# EAGLE design SECUREBRD_002 (EAGLE 7.7.0)

## Sheet 1 of 3
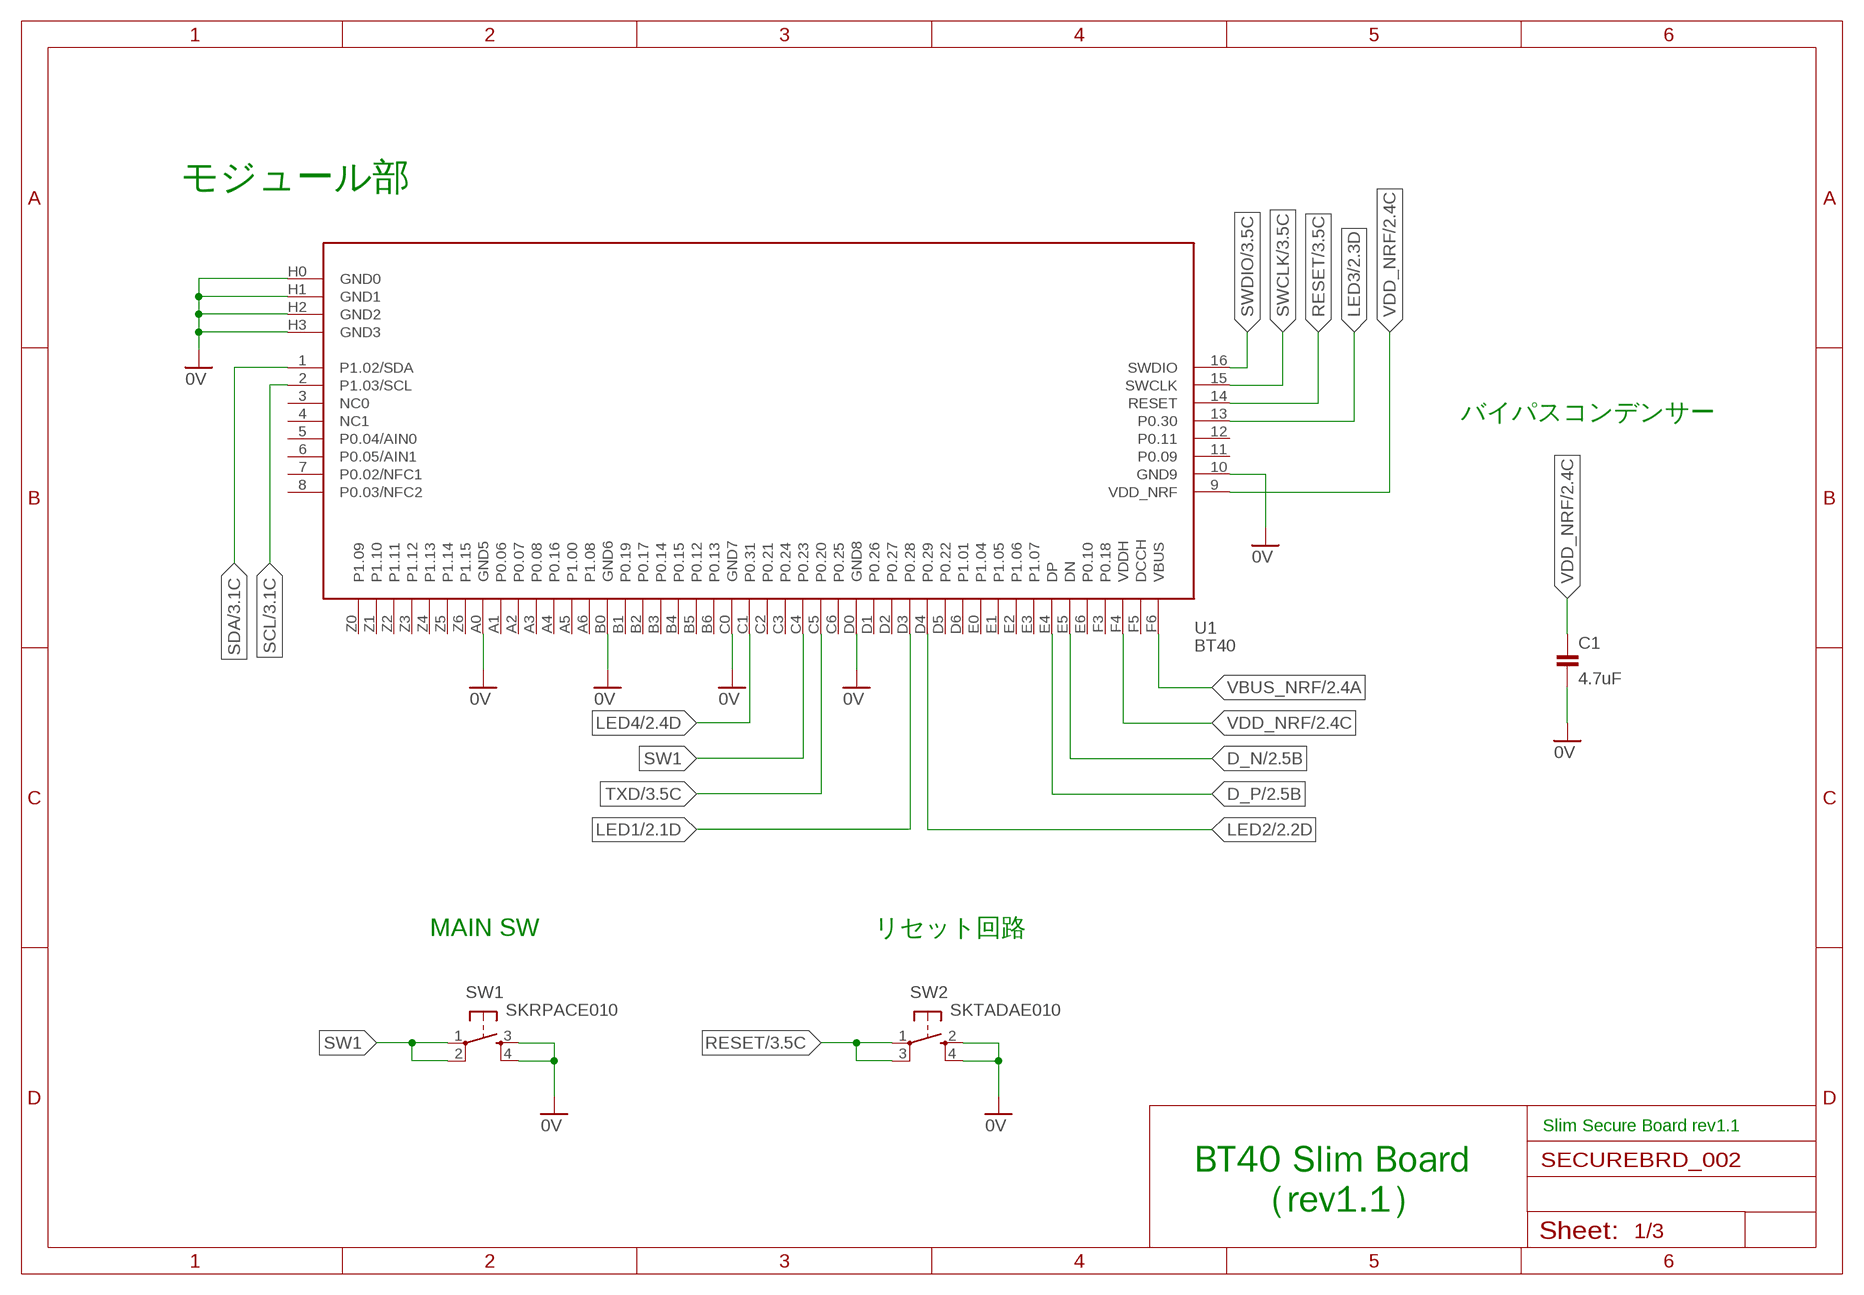
[diagram p0: schematic, sheet 1]

### Parts
C1  4.7uF  CAP_0603  [C0603K]
SW1  SKRPACE010  [SKRPACE010]
SW2  SKTADAE010  [SKTADAE010]
U1  BT40  [BM40-B_1PRIMARY]

### Nets
0V: C1.2 SW1.3(S) SW1.4(S1) SW2.2(S) SW2.4(S1) U1.10(GND9) U1.A0(GND5) U1.B0(GND6) U1.C0(GND7) U1.D0(GND8) U1.H0(GND0) U1.H1(GND1) U1.H2(GND2) U1.H3(GND3) ; also sheet 2,3
D_N: U1.E5(DN) ; also sheet 2
D_P: U1.E4(DP) ; also sheet 2
LED1: U1.D3(P0.28) ; also sheet 2
LED2: U1.D4(P0.29) ; also sheet 2
LED3: U1.13(P0.30) ; also sheet 2
LED4: U1.C1(P0.31) ; also sheet 2
RESET: SW2.1(P) SW2.3(P1) U1.14(RESET) ; also sheet 3
SCL: U1.2(P1.03/SCL) ; also sheet 3
SDA: U1.1(P1.02/SDA) ; also sheet 3
SW1: SW1.1(P) SW1.2(P1) U1.C4(P0.23)
SWCLK: U1.15(SWCLK) ; also sheet 3
SWDIO: U1.16(SWDIO) ; also sheet 3
TXD: U1.C5(P0.20) ; also sheet 3
VBUS_NRF: U1.F6(VBUS) ; also sheet 2,3
VDD_NRF: C1.1 U1.9(VDD_NRF) U1.F4(VDDH) ; also sheet 2,3
Unconnected: U1.3(NC0) U1.4(NC1) U1.5(P0.04/AIN0) U1.6(P0.05/AIN1) U1.7(P0.02/NFC1) U1.8(P0.03/NFC2) U1.11(P0.09) U1.12(P0.11) U1.A1(P0.06) U1.A2(P0.07) U1.A3(P0.08) U1.A4(P0.16) U1.A5(P1.00) U1.A6(P1.08) U1.B1(P0.19) U1.B2(P0.17) U1.B3(P0.14) U1.B4(P0.15) U1.B5(P0.12) U1.B6(P0.13) U1.C2(P0.21) U1.C3(P0.24) U1.C6(P0.25) U1.D1(P0.26) U1.D2(P0.27) U1.D5(P0.22) U1.D6(P1.01) U1.E0(P1.04) U1.E1(P1.05) U1.E2(P1.06) U1.E3(P1.07) U1.E6(P0.10) U1.F3(P0.18) U1.F5(DCCH) U1.Z0(P1.09) U1.Z1(P1.10) U1.Z2(P1.11) U1.Z3(P1.12) U1.Z4(P1.13) U1.Z5(P1.14) U1.Z6(P1.15)

### Notes on the sheet
- モジュール部
- バイパスコンデンサー
- MAIN SW | リセット回路
- Slim Secure Board rev1.1
- BT40 Slim Board
       （rev1.1）

## Sheet 2 of 3
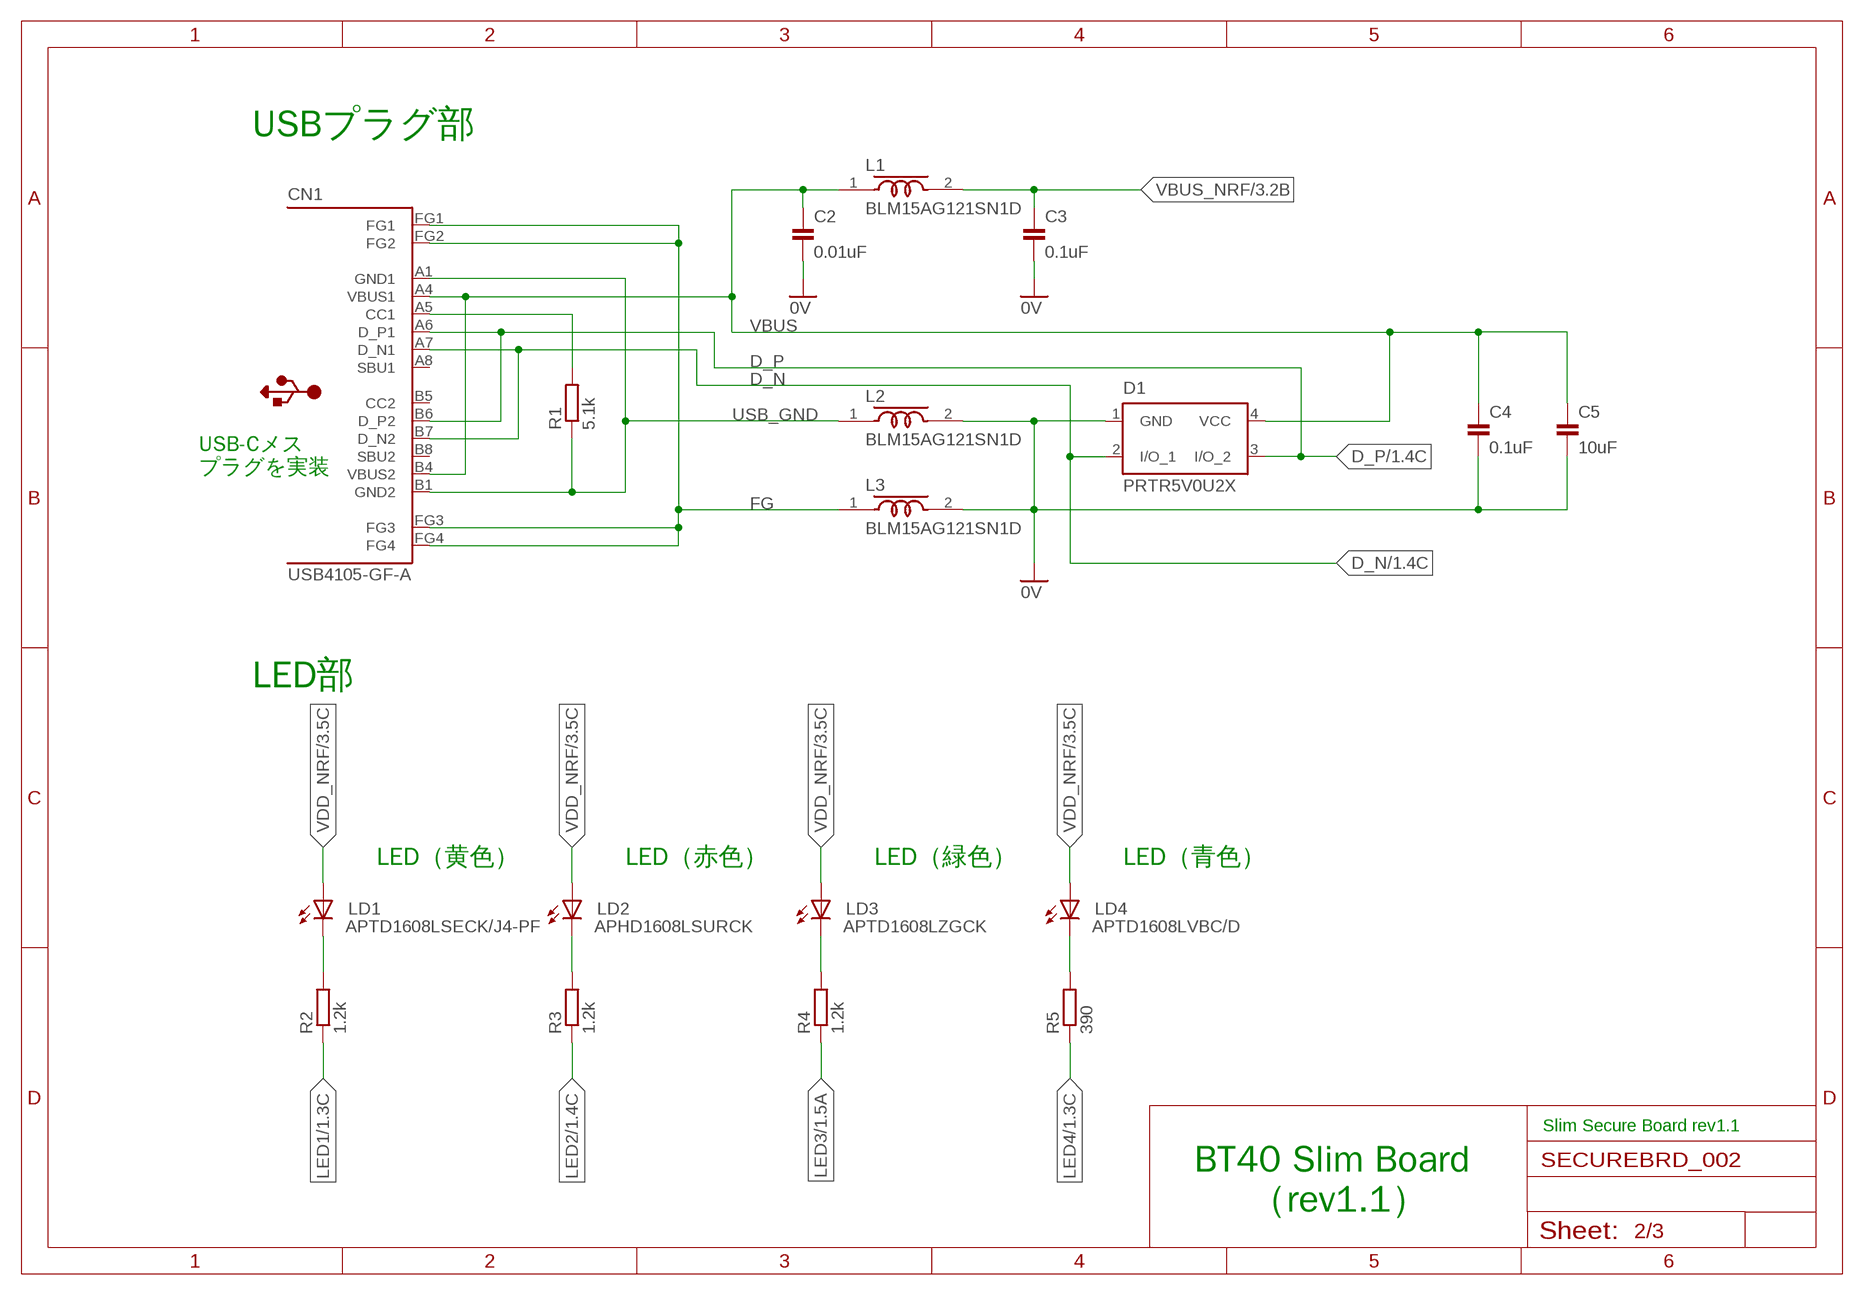
[diagram p1: schematic, sheet 2]

### Parts
C2  0.01uF  CAP_0402K  [C0402K]
C3  0.1uF  CAP_0402K  [C0402K]
C4  0.1uF  CAP_0402K  [C0402K]
C5  10uF  CAP_0603  [C0603K]
CN1  USB4105-GF-A  [USB4105-GF-A]
D1  PRTR5V0U2X  [SOT143B]
L1  BLM15AG121SN1D  [C0402K]
L2  BLM15AG121SN1D  [C0402K]
L3  BLM15AG121SN1D  [C0402K]
LD1  APTD1608LSECK/J4-PF  [APTD1608]
LD2  APHD1608LSURCK  [APTD1608]
LD3  APTD1608LZGCK  [APTD1608]
LD4  APTD1608LVBC/D  [APTD1608]
R1  5.1k  RESISTOR_0402  [R0402]
R2  1.2k  RESISTOR_0402  [R0402]
R3  1.2k  RESISTOR_0402  [R0402]
R4  1.2k  RESISTOR_0402  [R0402]
R5  390  RESISTOR_0402  [R0402]

### Nets
0V: C2.2 C3.2 C4.2 C5.2 D1.1(GND) L2.2 L3.2 ; also sheet 1,3
D_N: CN1.A7(D_N1) CN1.B7(D_N2) D1.2(I/O_1) ; also sheet 1
D_P: CN1.A6(D_P1) CN1.B6(D_P2) D1.3(I/O_2) ; also sheet 1
FG: CN1.FG1 CN1.FG2 CN1.FG3 CN1.FG4 L3.1
LED1: R2.1 ; also sheet 1
LED2: R3.1 ; also sheet 1
LED3: R4.1 ; also sheet 1
LED4: R5.1 ; also sheet 1
N$1: LD4.C R5.2
N$2: CN1.A5(CC1) R1.2
N$6: LD3.C R4.2
N$7: LD2.C R3.2
N$8: LD1.C R2.2
USB_GND: CN1.A1(GND1) CN1.B1(GND2) L2.1 R1.1
VBUS: C2.1 C4.1 C5.1 CN1.A4(VBUS1) CN1.B4(VBUS2) D1.4(VCC) L1.1
VBUS_NRF: C3.1 L1.2 ; also sheet 1,3
VDD_NRF: LD1.A LD2.A LD3.A LD4.A ; also sheet 1,3
Unconnected: CN1.A8(SBU1) CN1.B5(CC2) CN1.B8(SBU2)

### Notes on the sheet
- USBプラグ部
- USB-Cメス
  プラグを実装
- LED部
- LED（黄色） | LED（赤色） | LED（緑色） | LED（青色）
- Slim Secure Board rev1.1
- BT40 Slim Board
       （rev1.1）

## Sheet 3 of 3
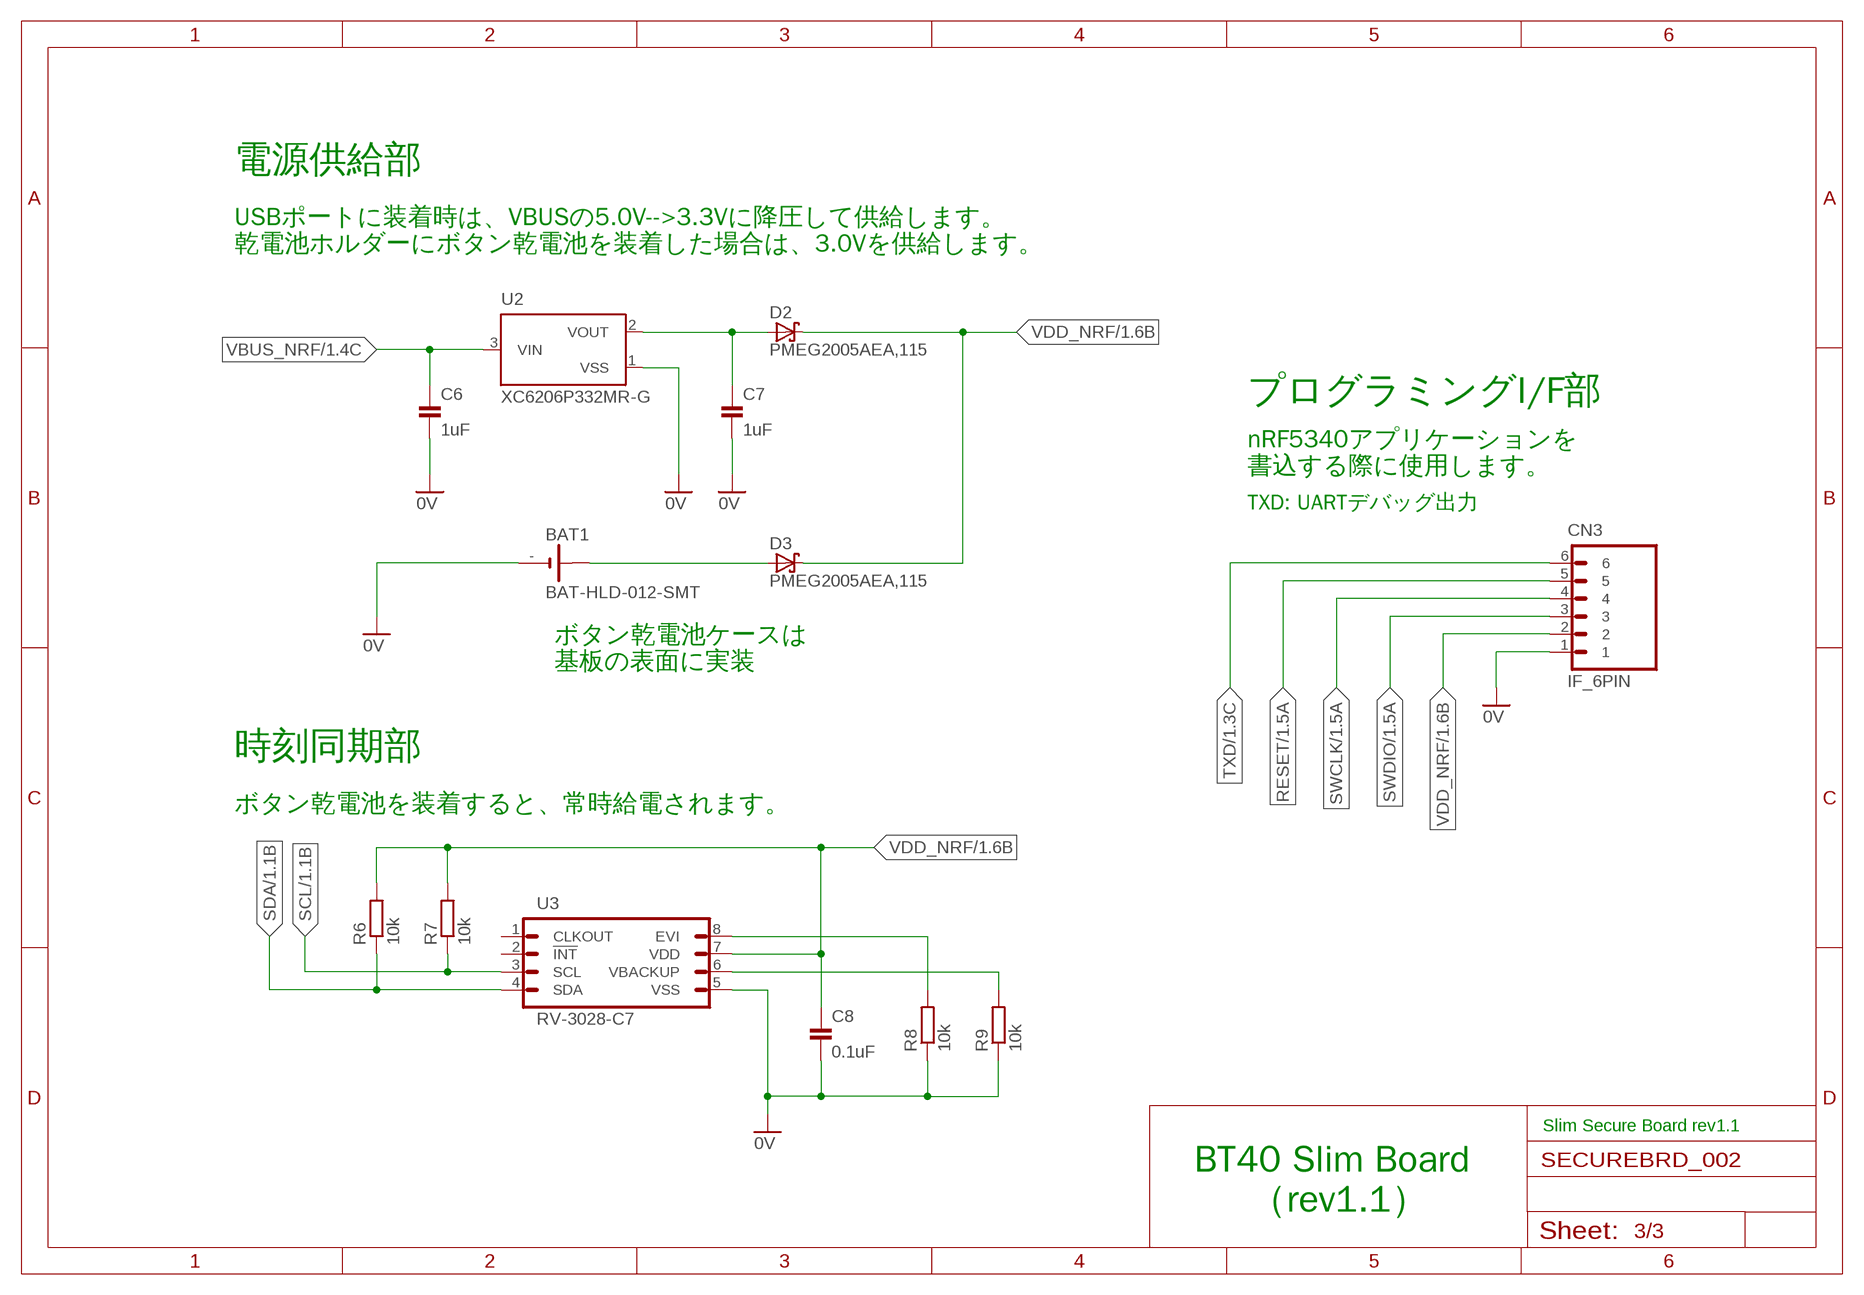
[diagram p2: schematic, sheet 3]

### Parts
BAT1  BAT-HLD-012-SMT  [BAT-HLD-012-SMT]
C6  1uF  CAP_0603  [C0603K]
C7  1uF  CAP_0603  [C0603K]
C8  0.1uF  CAP_0402K  [C0402K]
CN3  IF_6PIN  [HEADER_6PIN]
D2  PMEG2005AEA,115  [SOD323-W]
D3  PMEG2005AEA,115  [SOD323-W]
R6  10k  RESISTOR_0402  [R0402]
R7  10k  RESISTOR_0402  [R0402]
R8  10k  RESISTOR_0402  [R0402]
R9  10k  RESISTOR_0402  [R0402]
U2  XC6206P332MR-G  [SOT23]
U3  RV-3028-C7  [SON-8]

### Nets
0V: BAT1.- C6.2 C7.2 C8.2 CN3.1 R8.1 R9.1 U2.1(VSS) U3.5(VSS) ; also sheet 1,2
N$4: C7.1 D2.A U2.2(VOUT)
N$9: R9.2 U3.6(VBACKUP)
N$10: R8.2 U3.8(EVI)
RESET: CN3.5 ; also sheet 1
SCL: R7.1 U3.3(SCL) ; also sheet 1
SDA: R6.1 U3.4(SDA) ; also sheet 1
SWCLK: CN3.4 ; also sheet 1
SWDIO: CN3.3 ; also sheet 1
TXD: CN3.6 ; also sheet 1
VBUS_NRF: C6.1 U2.3(VIN) ; also sheet 1,2
VDD_BAT: BAT1.+@2(+) D3.A
VDD_NRF: C8.1 CN3.2 D2.C D3.C R6.2 R7.2 U3.7(VDD) ; also sheet 1,2
Unconnected: U3.1(CLKOUT) U3.2(!INT!)

### Notes on the sheet
- 電源供給部
- USBポートに装着時は、VBUSの5.0V-->3.3Vに降圧して供給します。
  乾電池ホルダーにボタン乾電池を装着した場合は、3.0Vを供給します。
- プログラミングI/F部
- nRF5340アプリケーションを
  書込する際に使用します。
- TXD: UARTデバッグ出力
- ボタン乾電池ケースは
  基板の表面に実装
- 時刻同期部
- ボタン乾電池を装着すると、常時給電されます。
- Slim Secure Board rev1.1
- BT40 Slim Board
       （rev1.1）

## Library data of the parts
BAT1 = Connectors:BAT-HLD-012-SMT: ボタン電池ホルダー(CR1216/1225)
C1-C8 = Parts:CAP: コンデンサー
CN1 = Connectors:USB4105-GF-A: USB Type C Receptacle for USB 2.0
CN3 = Connectors:IF_6PIN: 6-pin インターフェース
D1 = Parts:PRTR5V0U2X: ESD protection diode
D2 D3 = Parts:PMEG2005: ショットキーダイオード If - 順電流: 500 mA Vrrm - 繰返し逆電圧: 20 V Vf - 順電圧: 0.39 V Ifsm - 順方向サージ電流: 10 A 最低動作温度: - 65 C 最高動作温度: + 150 C
L1-L3 = Parts:BLM15AG: フェライトビーズ EMIFIL®
LD1 LD3 LD4 = Parts:APTD1608: 発光ダイオード
LD2 = Parts:APHD1608: 発光ダイオード
R1-R9 = Parts:RESISTOR: 抵抗器
SW1 = Parts:SKRPACE010: 表面実装用タクトスイッチ ４．２×３．２ｍｍ小型重作動力タイプ ・作動力：２．５５Ｎ ・操作方向：垂直 ・移動量：０．２ｍｍ ・動作寿命：５０，０００ｃｙｃｌｅｓ （５ｍＡ ５ＶＤＣ） ・初期接触抵抗：最大５００ｍΩ
SW2 = Parts:SKTADAE010: 表面実装用タクトスイッチ 2.6×1.6ｍｍ小型重作動力タイプ ・作動力：2.4 N ・操作方向：垂直 ・移動量：0.11 mm ・定格：50 mA 12 VDC
U1 = Modules:BT40: BLE 5.2, 802.15.4 Modules ・nRF5340 QKAA, dual core ARM® Cortex M33 ・128/64 MHz Cortex M33 with FPU and DSP instructions ・1MB flash, 512KB RAM ・DC-DC converter, inductors for VDD, VDDH on board. ・Direct powered by Lithium batteries or USB supply (up to 5.5V)
U2 = Parts:XC6206: 電圧レギュレータ 出力電圧: 3.3 V 出力電流: 200 mA 入力電圧最大値: 6 V 最小入力電圧: 1.8 V 動作供給電流: 1 uA 最低動作温度: - 40 C 最高動作温度: + 85 C
U3 = ICs:RV-3028-C7: Extreme Low Power RTC Module Supply Voltage: 1.2 V 〜 5.5 V Operating Temperature: - 40 C 〜 + 85 C 3.2 mm x 1.5 mm

## Board
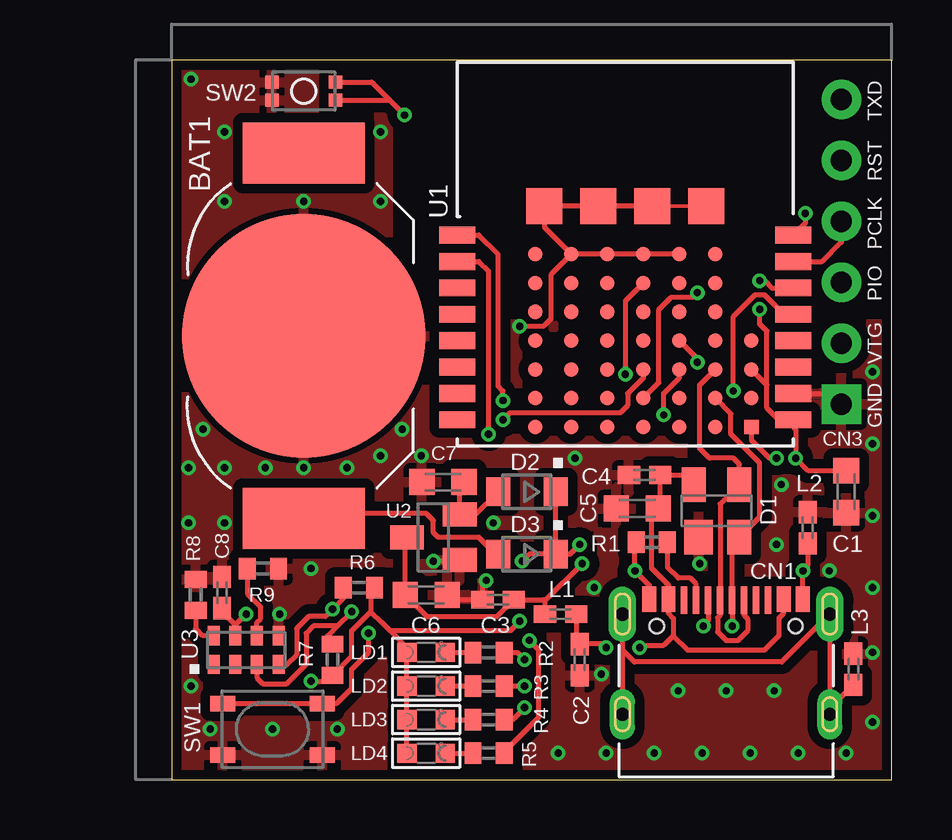
[diagram p3: board, top side]
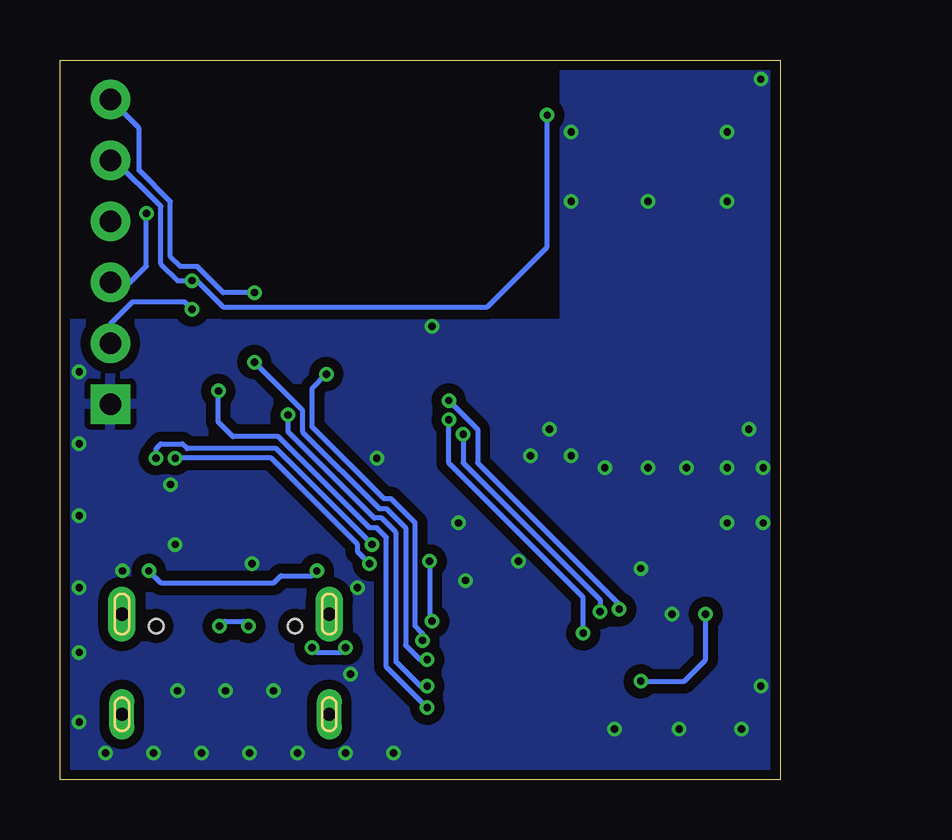
[diagram p4: board, bottom side, seen from below]

Size 30 x 30 mm. Coordinates in mm from the lower left corner, seen from the top.
Outline: 0,0 30,0 30,30 0,30 0,0
Copper layers (1*16): Top 0.035mm / dielectric 1.5mm / Bottom 0.035mm
Design rules "SeeedStudio_2layer_DRU_no_angle_20140221 *": minimum track width 6mil, minimum drill 0.3mm, track to track 6mil, track to pad 6mil, pad to pad 6mil, via to via 6mil, smd to smd 0mil, copper to edge 10mil, drill to drill 10mil, minimum pad ring 4mil, minimum via ring 6mil, stop-mask expansion 2mil, vias tented up to drill 100mil, thermal gap 10mil

### Footprints (pad centres in the part's own frame; a part is rotated, then mirrored left to right if it is on the bottom)
BAT-HLD-012-SMT = smd 2.54 x 5.08: +@1 -7.62,0; +@2 7.62,0 | smd 10.16 x 10.16: - 0,0
C0603K = smd 1.05 x 1.08: 1 -0.875,0; 2 0.875,0
C0402K = smd 0.925 x 0.74: 1 -0.65,0; 2 0.65,0
USB4105-GF-A = smd 0.58 x 1.05: A1 -3.2,0.625; A4 -2.4,0.625; B1 3.2,0.625; B4 2.4,0.625 | smd 0.28 x 1.15: A5 -1.25,0.575; A6 -0.25,0.575; A7 0.25,0.575; A8 1.25,0.575; B5 1.75,0.575; B6 0.75,0.575; B7 -0.75,0.575; B8 -1.75,0.575 | drill 0.55 pad 1.15 long: FG1 -4.32,0; FG3 4.32,0 | drill 0.55 pad 1.05 long: FG2 -4.32,-4.18; FG4 4.32,-4.18 | hole 0.6: -2.89,-0.5; 2.89,-0.5
HEADER_6PIN = drill 0.889 pad 1.651 square: 1 -6.35,0 | drill 0.889 pad 1.651: 2 -3.81,0; 3 -1.27,0; 4 1.27,0; 5 3.81,0; 6 6.35,0
SOT143B = smd 1.2 x 1.44: 1 -0.75,-1.1 | smd 1 x 1.44: 2 0.95,-1.1; 3 0.95,1.1; 4 -0.95,1.1
SOD323-W = smd 1 x 1.2: A 1.2,0; C -1.2,0
APTD1608 = smd 0.8 x 0.8: A -0.8,0; C 0.8,0
R0402 = smd 0.7 x 0.9: 1 -0.65,0; 2 0.65,0
SKRPACE010 = smd 1.05 x 0.65: 1 -2.075,1.075; 2 2.075,1.075; 3 -2.075,-1.075; 4 2.075,-1.075
SKTADAE010 = smd 0.55 x 0.55: 1 -1.325,0.375; 2 1.325,0.375; 3 -1.325,-0.375; 4 1.325,-0.375
BM40-B_1PRIMARY = smd 1.5 x 0.7: 1 0,8.8; 2 0,7.7; 3 0,6.6; 4 0,5.5; 5 0,4.4; 6 0,3.3; 7 0,2.2; 8 0,1.1; 9 14,1.1; 10 14,2.2; 11 14,3.3; 12 14,4.4; 13 14,5.5; 14 14,6.6; 15 14,7.7; 16 14,8.8 | smd 0.6 x 0.6: A0 4.75,8; A1 4.75,6.8; A2 4.75,5.6; A3 4.75,4.4; A4 4.75,3.2; A5 4.75,2; A6 4.75,0.8; B0 6.25,8; B1 6.25,6.8; B2 6.25,5.6; B3 6.25,4.4; B4 6.25,3.2; B5 6.25,2; B6 6.25,0.8; C0 7.75,8; C1 7.75,6.8; C2 7.75,5.6; C3 7.75,4.4; C4 7.75,3.2; C5 7.75,2; C6 7.75,0.8; D0 9.25,8; D1 9.25,6.8; D2 9.25,5.6; D3 9.25,4.4; D4 9.25,3.2; D5 9.25,2; D6 9.25,0.8; E0 10.75,8; E1 10.75,6.8; E2 10.75,5.6; E3 10.75,4.4; E4 10.75,3.2; E5 10.75,2; E6 10.75,0.8; F3 12.25,4.4; F4 12.25,3.2; F5 12.25,2; F6 12.25,0.8; Z0 3.25,8; Z1 3.25,6.8; Z2 3.25,5.6; Z3 3.25,4.4; Z4 3.25,3.2; Z5 3.25,2; Z6 3.25,0.8 | smd 1.5 x 1.5: H0 3.625,10; H1 5.875,10; H2 8.125,10; H3 10.375,10
SOT23 = smd 1 x 1.4: 1 -0.95,-1.1; 2 0.95,-1.1; 3 0,1.1
SON-8 = smd 0.5 x 0.8: 1 0.25,0.4; 2 1.15,0.4; 3 2.05,0.4; 4 2.95,0.4; 5 2.95,1.6; 6 2.05,1.6; 7 1.15,1.6; 8 0.25,1.6

### Placement (x,y rotation side)
BAT1  5.5,18.5 270 top
C1  28.1,12 270 top
C2  17,5 270 top
C3  13.6,7.5 180 top
C4  19.7,12.7 180 top
C5  19.4,11.3 180 top
C6  10.6,7.7 0 top
C7  11.3,12.4 180 top
C8  2.1,7.8 90 top
CN1  23.1,6.9 0 top
CN3  27.9,22 90 top
D1  22.7,11.2 0 top
D2  14.8,12 180 top
D3  14.8,9.4 180 top
L1  16.2,6.9 180 top
L2  26.5,10.5 90 top
L3  28.4,4.6 90 top
LD1  10.6,5.3 0 top
LD2  10.6,3.9 0 top
LD3  10.6,2.5 0 top
LD4  10.6,1.1 0 top
R1  20,9.9 0 top
R2  13.2,5.3 180 top
R3  13.2,3.9 180 top
R4  13.2,2.5 180 top
R5  13.2,1.1 180 top
R6  7.8,8 0 top
R7  6.7,5 270 top
R8  1,7.7 270 top
R9  3.8,8.8 180 top
SW1  4.2,2.1 0 top
SW2  5.5,28.7 180 top
U1  11.9,13.9 0 top
U2  10.9,10.1 90 top
U3  1.5,4.4 0 top

### Tracks (layer width: path | path; a pad name or v marks a point on that pad's centre or on a via)
0V  (via drill 0.3)
  Top 0.152: U1.H2 U1.H3
  Top 0.203: U1.A0 15.8,21.05 15.8,19.2 15.5,18.9 v14.5,18.9 | U1.D0 U1.C0 U1.B0 U1.A0 | U1.A0 15.53,23.02 U1.H0 U1.H1 U1.H2 | U1.10 27.45,16.1 CN3.1 | 12.95,7.35 C3.2 | U2.1 12.15,9.15 12.1,9.1 v10.9,9.1 | C3.2 11.68,7.5 C6.2 | C3.2 12.95,8.15 v13.1,8.3
  other vias: 22,9 29.2,8 16.8,13.4 25.2,9.8 22.1,1.1 26.1,1.1 20.1,1.1 24.1,1.1 23.1,3.7 25.1,3.7 21.1,3.7 25.4,12.3 28.1,1.1 18.1,1.1 16.1,1.1 10.4,13.5 2.2,13 2.2,10.7 0.8,3.9 6.9,2.1 4.2,2.1 1.6,2.1 4.5,6.9 5.8,8.8 7.3,13 29.2,17 29.2,14 29.2,11 29.2,5.3 29.2,2.4 8.7,13.5 5.5,13 0.7,10.7 0.7,13 1.3,14.6 9.6,14.6 2.2,24.1 5.5,24.1 8.7,24.1 8.7,27 2.2,27 0.8,29.2 17.6,8 27.4,8.7 17.9,4.4 13.4,10.7 3.9,13
  pour Bottom (isolate 0.406, rank 3): 9,31 9,19 31,19 31,-1 -1,-1 -1,31
  pour Top (isolate 0.406, rank 3): -2,32 9,32 9,19 32,19 32,-2 -2,-2
D_N  (via drill 0.3)
  Top 0.203: v23.35,6.4 CN1.A7 23.35,9.8 D1.2 24.5,10.95 24.5,13.2 23.3,14.4 23.3,15.25 U1.E5 | CN1.B7 22.35,6.6 v22.15,6.4
  Bottom 0.203: v22.15,6.4 22.35,6.6 23.15,6.6 v23.35,6.4
D_P
  Top 0.203: CN1.B6 23.85,6.85 24,6.7 24,6.2 23.6,5.8 23.1,5.8 22.75,6.15 22.75,6.75 22.85,6.85 CN1.A6 22.85,11.5 D1.3 23.65,13.15 23.4,13.4 22.4,13.4 22,13.8 22,16.45 U1.E4
FG
  Top 0.203: 18.78,5.4 CN1.FG1 18.78,6.82 | 18.78,5.4 CN1.FG2 | 18.78,5.4 19.28,4.9 25.42,4.9 CN1.FG3 CN1.FG4 27.42,2.97 L3.1
LED1  (via drill 0.3)
  Top 0.203: R2.1 14.4,5.3 v14.7,5 | v21.9,17.4 21.9,17.55 U1.D3
  Bottom 0.203: v21.9,17.4 19.9,15.4 19.9,14.5 16.7,11.3 16.4,11.3 15.6,10.5 15.6,5.6 15,5 v14.7,5
LED2  (via drill 0.3)
  Top 0.203: R3.1 v14.7,3.9 | v20.5,15.2 20.5,16.1 21.15,16.75 U1.D4
  Bottom 0.203: v14.7,3.9 15,3.9 16,4.9 16,10.3 16.6,10.9 16.9,10.9 20.5,14.5 v20.5,15.2
LED3  (via drill 0.3)
  Top 0.203: R4.1 14.2,2.5 v14.7,3 | v23.4,16.2 23.4,19.3 24.3,20.2 24.7,20.2 25.5,19.4 U1.13
  Bottom 0.203: v14.7,3 16.4,4.7 16.4,10.1 16.8,10.5 17.1,10.5 20.9,14.3 22.8,14.3 23.4,14.9 v23.4,16.2
LED4  (via drill 0.3)
  Top 0.203: R5.1 13.85,1.15 15.3,2.6 15.3,5.4 v14.9,5.8 | U1.C1 18.9,19.95 v18.9,16.9
  Bottom 0.203: v14.9,5.8 14.9,6.1 15.2,6.4 15.2,10.7 16.2,11.7 16.5,11.7 19.5,14.7 19.5,16.3 v18.9,16.9
N$1
  Top 0.203: LD4.C R5.2
N$2
  Top 0.203: CN1.A5 21.85,8.15 21.6,8.4 21.1,8.4 20.65,8.85 R1.2
N$4
  Top 0.203: D2.A 12.65,11.05 U2.2 12,12.22 C7.1
N$6
  Top 0.203: LD3.C R4.2
N$7
  Top 0.203: LD2.C R3.2
N$8
  Top 0.203: LD1.C R2.2
N$9
  Top 0.203: U3.6 3.55,6.55 3.7,6.7 3.7,7.2 3.15,7.75 R9.2
N$10
  Top 0.203: U3.8 1.3,6 1,6.3 R8.2
RESET  (via drill 0.3)
  Top 0.203: SW2.3 8.32,29.07 v9.7,27.7 9.07,28.32 SW2.1 | v24.5,20.8 24.7,20.8 25,20.5 U1.14
  Bottom 0.203: v9.7,27.7 9.7,22.2 12.2,19.7 23.2,19.7 24.3,20.8 v24.5,20.8 25.1,20.8 25.8,21.5 25.8,23.9 27.71,25.81 CN3.5
SCL  (via drill 0.3)
  Top 0.203: U3.3 3.55,4.25 3.8,4 4.8,4 5.6,4.8 5.6,6.1 5.9,6.4 6.9,6.4 | 6.9,6.4 6.5,6 R7.1 | v13.2,14.4 13.2,21.2 12.8,21.6 U1.2 | 6.9,6.4 v7.5,7
  Bottom 0.203: v13.2,14.4 13.2,13.2 7.5,7.5 v7.5,7
SDA  (via drill 0.3)
  Top 0.203: U3.4 4.8,4.8 5.2,5.2 5.2,6.3 5.7,6.8 6.4,6.8 v6.7,7.1 7.15,7.55 R6.1 | v13.8,15.8 13.8,16.2 13.6,16.4 13.6,21.9 12.8,22.7 U1.1
  Bottom 0.203: v13.8,15.8 12.6,14.6 12.6,13.2 6.7,7.3 v6.7,7.1
SW1  (via drill 0.3)
  Top 0.203: SW1.1 SW1.2 6.88,3.17 7.5,3.8 7.5,4.6 8.2,5.3 v8.2,6.1 | v13.8,15 14.1,15.3 18.7,15.3 19,15.6 19,16.1 19.65,16.75 U1.C4
  Bottom 0.203: v13.8,15 13.8,13.2 8.2,7.6 v8.2,6.1
SWCLK
  Top 0.203: U1.15 27.1,21.6 27.9,22.4 CN3.4
SWDIO  (via drill 0.3)
  Top 0.203: v26.4,23.6 26.4,23.2 U1.16
  Bottom 0.203: v26.4,23.6 26.4,21.4 27.07,20.73 CN3.3
TXD  (via drill 0.3)
  Top 0.203: U1.C5 20.3,16.55 20.3,19.6 20.8,20.1 21.7,20.1 v21.9,20.3
  Bottom 0.203: v21.9,20.3 23.2,20.3 24.3,21.4 25,21.4 25.4,21.8 25.4,24.1 26.7,25.4 26.7,27.15 CN3.6
USB_GND  (via drill 0.3)
  Top 0.203: CN1.B1 v26.3,8.7 26.5,8.9 L2.1 | CN1.A1 19.9,8.1 v19.3,8.7 19.3,9.85 R1.1
  Bottom 0.203: v26.3,8.7 25.8,8.2 21.1,8.2 20.8,8.5 19.5,8.5 v19.3,8.7
VBUS  (via drill 0.3)
  Top 0.203: L1.1 16.85,5.8 C2.1 | C2.1 17.05,5.6 | 20.9,6 20.9,6.72 20.7,6.92 CN1.A4 20.7,8.1 20,8.8 20,11.03 C5.1 20.35,11.38 C4.1 21.35,12.7 D1.4 | 20.9,6 21.5,5.4 24.7,5.4 25.3,6 25.3,6.72 25.5,6.92 CN1.B4 | 20.9,6 20.5,5.6 19.6,5.6 v19.5,5.5 | v18.1,5.5 17.95,5.65 C2.1
  Bottom 0.203: v18.1,5.5 18.3,5.3 19.3,5.3 v19.5,5.5
VBUS_NRF  (via drill 0.3)
  Top 0.203: U1.F6 24.15,14.15 24.9,13.4 v25.2,13.4 | 15.55,6.95 L1.2 15.55,7.45 | v17.1,9 15.55,7.45 | 15.55,7.45 15.5,7.5 C3.1 13.55,6.8 10.62,6.8 C6.1 9.72,10.03 U2.3
  Bottom 0.203: v25.2,13.4 21.2,13.4 17.6,9.8 17.6,9.5 v17.1,9
VDD_BAT
  Top 0.203: 4.75,10.33 BAT1.+@2 5.72,11.1 10.6,11.1 10.9,10.8 10.9,10.3 11.1,10.1 12.8,10.1 13.4,9.5 13.5,9.5 D3.A
VDD_NRF  (via drill 0.3)
  Top 0.152: D3.C 16,9.1
  Top 0.203: v3.1,6.9 2.65,6.45 | 2.65,6.45 U3.7 | v5.8,4.1 6.45,4.1 R7.2 7.5,5.15 7.5,6.2 8.3,7 | 24.8,16.45 U1.F4 | LD1.A 9.9,5.3 | LD4.A LD3.A LD2.A LD1.A | D3.C D2.C 16,12.2 | 24.8,16.45 24.8,18.7 24.5,19 v24.5,19.6 | 24.8,16.45 24.8,15.5 25.3,15 U1.9 25.9,14.7 26,14.6 v26,13.4 26.52,12.88 C1.1 | D3.C 16.6,9.4 v17,9.8 | 8.3,7 8.75,6.55 9.1,6.2 | 9.1,6.2 9.8,5.5 LD1.A | 8.3,7 8.3,7.85 R6.2 | C8.1 2.1,7 2.65,6.45 | D3.C 14.9,9.4 v14.6,9.1 | v14.5,6.6 14.1,6.2 9.1,6.2
  Bottom 0.203: v5.8,4.1 4,4.1 3.1,5 v3.1,6.9 | v26,13.4 26,13.8 25.8,14 24.9,14 24.7,13.8 21,13.8 v17,9.8 | v24.5,19.6 24.8,19.9 27,19.9 27.9,19 CN3.2 | v14.6,9.1 14.6,6.7 v14.5,6.6

### Text on the board
tPlace: TXD | RST | PCLK | PIO | VTG | GND